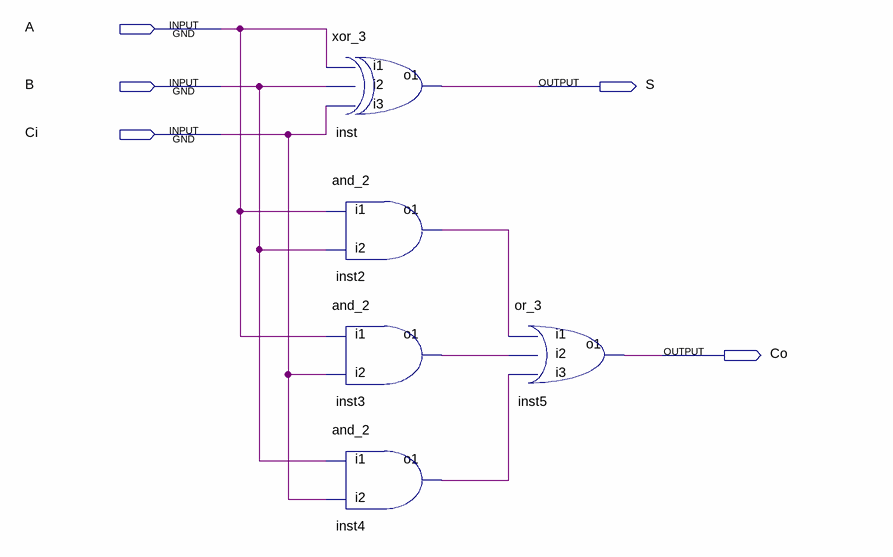
[diagram p0: schematic sheet]
// Quartus schematic FA.bdf as structural Verilog: 5 symbols, 5 pins
module FA (
  input  A,
  input  B,
  input  Ci,
  output S,
  output Co
);

  wire inst2_o1, inst3_o1, inst4_o1;

  xor_3 inst (.i1(A), .i2(B), .i3(Ci), .o1(S));
  and_2 inst2 (.i1(A), .i2(B), .o1(inst2_o1));
  and_2 inst3 (.i1(A), .i2(Ci), .o1(inst3_o1));
  and_2 inst4 (.i1(B), .i2(Ci), .o1(inst4_o1));
  or_3 inst5 (.i1(inst2_o1), .i2(inst3_o1), .i3(inst4_o1), .o1(Co));
endmodule
